# Altium project PPS_Buffer.PrjPcb
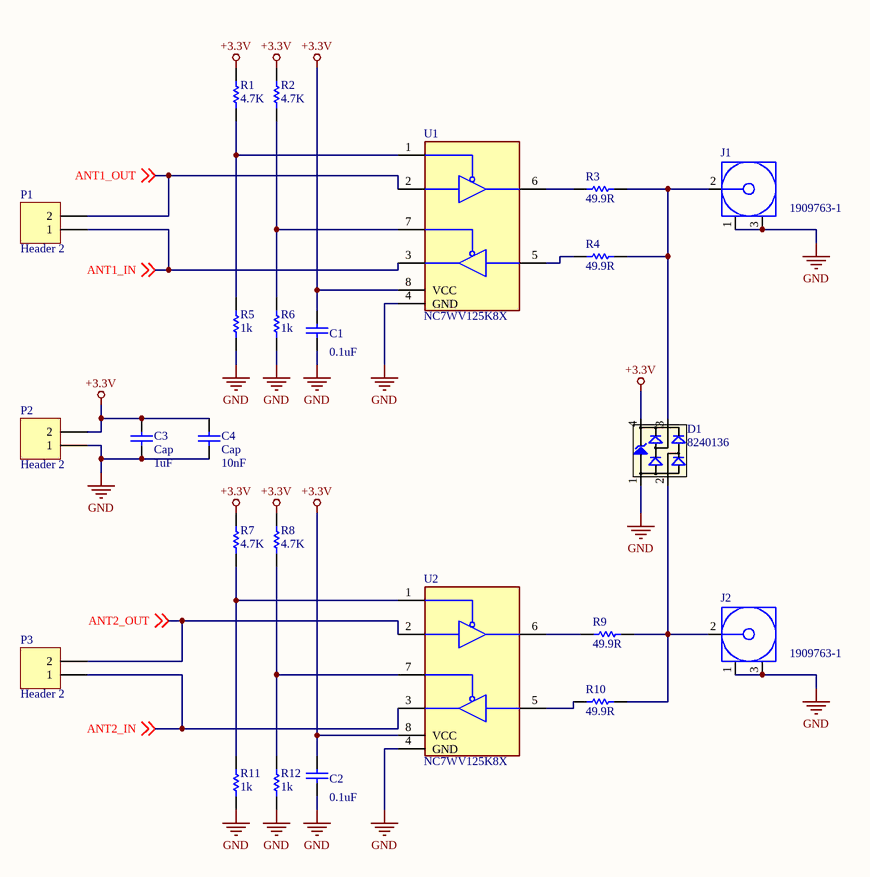
[diagram p0: PPS_BUFFER.SchDoc]
1 sheet, 24 parts. Net scope: global (net labels, ports and power ports of the same name join across sheets).
Board file: PPS_Buffer.PcbDoc

## Sheet PPS_BUFFER.SchDoc
size A; SheetNumber: 1; SheetTotal: 1

### Parts
C1  0.1uF  [CAPC1608X87X45ML20T05]
C2  0.1uF  [CAPC1608X87X45ML20T05]
C3  Cap  value 1uF  [6-0805_L]
C4  Cap  value 10nF  [6-0805_L]
D1  8240136  [SOT143-4L]
J1  1909763-1  [TECO-1909763-1_V]
J2  1909763-1  [TECO-1909763-1_V]
P1  Header 2  [3.5X2.8X1.9]  (no BOM)
P2  Header 2  [3.5X2.8X1.9]  (no BOM)
P3  Header 2  [3.5X2.8X1.9]  (no BOM)
R1  4.7K  [RESC1608X55X30NL15T15]
R2  4.7K  [RESC1608X55X30NL15T15]
R3  49.9R  [RESC1608X55X25NL10T15]
R4  49.9R  [RESC1608X55X25NL10T15]
R5  1k  [RESC1608X55X25NL10T15]
R6  1k  [RESC1608X55X25NL10T15]
R7  4.7K  [RESC1608X55X30NL15T15]
R8  4.7K  [RESC1608X55X30NL15T15]
R9  49.9R  [RESC1608X55X25NL10T15]
R10  49.9R  [RESC1608X55X25NL10T15]
R11  1k  [RESC1608X55X25NL10T15]
R12  1k  [RESC1608X55X25NL10T15]
U1  NC7WV125K8X  [SOP50P310X90-8N]
U2  NC7WV125K8X  [SOP50P310X90-8N]

### Nets
+3.3V: C1.1 C2.1 C3.1 C4.1 D1.4(VDD) P2.2 R1.2 R2.2 R7.2 R8.2 U1.8(VCC) U2.8(VCC)
GND: C1.2 C2.2 C3.2 C4.2 D1.1(GND) J1.1 J1.3 J2.1 J2.3 P2.1 R5.1 R6.1 R11.1 R12.1 U1.4(GND) U2.4(GND)
ANT1_IN: P1.1 U1.3 ; off-sheet ANT1_IN
ANT1_OUT: P1.2 U1.2 ; off-sheet ANT1_OUT
ANT2_IN: P3.1 U2.3 ; off-sheet ANT2_IN
ANT2_OUT: P3.2 U2.2 ; off-sheet ANT2_OUT
NetD1_2: D1.2(I/O1) J2.2 R9.2 R10.2
NetD1_3: D1.3(I/O2) J1.2 R3.2 R4.2
NetR1_1: R1.1 R5.2 U1.1
NetR2_1: R2.1 R6.2 U1.7
NetR3_1: R3.1 U1.6
NetR4_1: R4.1 U1.5
NetR7_1: R7.1 R11.2 U2.1
NetR8_1: R8.1 R12.2 U2.7
NetR9_1: R9.1 U2.6
NetR10_1: R10.1 U2.5

### Library data of the parts
C1 C2 = CMP-2006-00003-1: C0603X104K5RACAUTO; Manufacturer: Kemet; Part Number: C0603X104K5RACAUTO
C3 C4 = Cap: Capacitor; Published: 8-Jun-2000; LatestRevisionDate: 17-Jul-2002; LatestRevisionNote: Re-released for DXP Platform.; PackageReference: RAD-0.3; Publisher: Altium Limited; PackageDescription: Radial Cap, Thru-Hole; 2 Leads; 0.3 in Pin Spacing
D1 = CMP-1486-00002-1: TVS Diode WE-TVS-HS, VRWM=3.3V; Manufacturer: Wuerth Elektronik; Reverse Stand Off Voltage: 3.3V; PartNumber: 8240136; ComponentLink1Description: Manufacturer URL; PackageReference: SOT143-4L; ComponentLink1URL: http://www.we-online.com; ComponentLink2Description: Datasheet; ComponentLink2URL: http://katalog.we-online.de/kataloge/eisos/media/pdf/8240136.pdf
J1 J2 = CMP-2000-07505-1: Ultra Miniature Coaxial Connector Jack, 60 V, 50 Ohm, -40 to 90 degC, RoHS, Tape and Reel; Manufacturer: TE Connectivity; Gender: Female; PCB Mounting Orientation: Vertical; Body Material: LiquidCrystalPolymer; Case\/Package: SMD/SMT; Impedance: 50Ohm; Max Frequency: 6GHz; Body Plating: Gold; Dielectric Material: Polymer; Orientation: Straight; Mount: SurfaceMount; Length: 3mm; Packaging: TapeandReel; Connector Type: Jack; Lead Free: LeadFree; Package Quantity: 1; Termination: SMD/SMT; Contact Material: CopperAlloy; Fastening Type: Pull; RoHSCompliant: true; Max Operating Temperature: 90degC; Datasheet URL: http://www.te.com/commerce/DocumentDelivery/DDEController?Action=srchrtrv&DocNm=1909763&DocType=Customer+Drawing&DocLang=English; Contact Plating: Gold; Mounting Technology: SurfaceMount; Package Reference: TECO-1909763-1; Insulation Material: Thermoplastic; Min Operating Temperature: -40degC; Manufacturer URL: http://www.te.com/; ELV: Compliant; Datasheet Version: Rev. B2, 11/2015; Radiation Hardening: No; Package Description: 3-Pin Surface Mount Device, Body 2.6 x 2.6 mm; Housing Colour: Beige
P1-P3 = Header 2: Header, 2-Pin; LatestRevisionDate: 17-Jul-2002; LatestRevisionNote: Re-released for DXP Platform.; Publisher: Altium Limited
R1 R2 R7 R8 = CMP-1012-00586-3: Precision Thick Film Chip Resistor, 4.7 KOhm, +/- 1%, -55 to 155 degC, 0603 (1608 Metric), RoHS, Tape and Reel ERJ-3EKF4701V; Resistance: 220 Ohm; Voltage Rating: 50 V; Elements: 4; Case\Package: 1205; Tolerance: 5%; Power Rating: 250 mW; PackageReference: 0603; Max Operating Temperature: 125 degC; REACH SVHC: No SVHC; Width: 0.063 inch; Length: 0.126 inch; Height: 0.024 inch; Mount: Surface Mount; Package Quantity: 1; DatasheetVersion: Apr-15; ComponentLink1Description: Manufacturer URL; Min Operating Temperature: -55 degC; Packaging: Tape and Reel; Radiation Hardening: No; ComponentLink2URL: http://industrial.panasonic.com/cdbs/www-data/pdf/RDA0000/AOA0000C86.pdf; Case Code (Metric): 3216; Pins: 8; Case Code (Imperial): 1206; Type (Resistor): Thick Film; RoHSCompliant: true; ComponentLink2Description: Datasheet; PackageDescription: 2-Pin Surface Mount Device, Body 1.6 x 0.85 mm; ComponentLink1URL: http://www.panasonic.com/
R3-R6 R9-R12 = CMP-1659-00036-1: General Purpose Chip Resistor, 49.9 Ohm, +/- 1%, -55 to 155 degC, 0603 (1608 Metric), RoHS, Tape and Reel; Max Supply Voltage: 3.63 V; Case\Package: LQFP; Interface: SPI; Min Supply Voltage: 2.97 V; PackageReference: 0603; Packaging: Tray; ComponentLink2Description: Datasheet; ComponentLink1Description: Manufacturer URL; ComponentLink2URL: https://datasheet.ciiva.com/11808/0900766b80f96399-11808223.pdf; RoHSCompliant: true; Max Operating Temperature: 85 degC; ComponentLink1URL: http://www.yageo.com/; PackageDescription: 2-Pin Surface Mount Device, Body 1.6 x 0.8 mm; DatasheetVersion: Rev. 4, 04/2009; Min Operating Temperature: -40 degC; Package Quantity: 250; Pins: 48
U1 U2 = NC7WV125K8X: Integrated Circuit; Manufacturer_Name: ON Semiconductor; Datasheet Link: https://www.mouser.com/datasheet/2/308/NC7WV125-1301459.pdf; Height: 0.9mm; Manufacturer_Part_Number: NC7WV125K8X; Mouser Part Number: 512-NC7WV125K8X; Mouser Price/Stock: https://www.mouser.com/Search/Refine.aspx?Keyword=512-NC7WV125K8X; Arrow Part Number: NC7WV125K8X; Arrow Price/Stock: https://www.arrow.com/en/products/nc7wv125k8x/on-semiconductor
  U1: Supplier 1: Newark